# EAGLE schematic Control board (EAGLE 9.6.2)
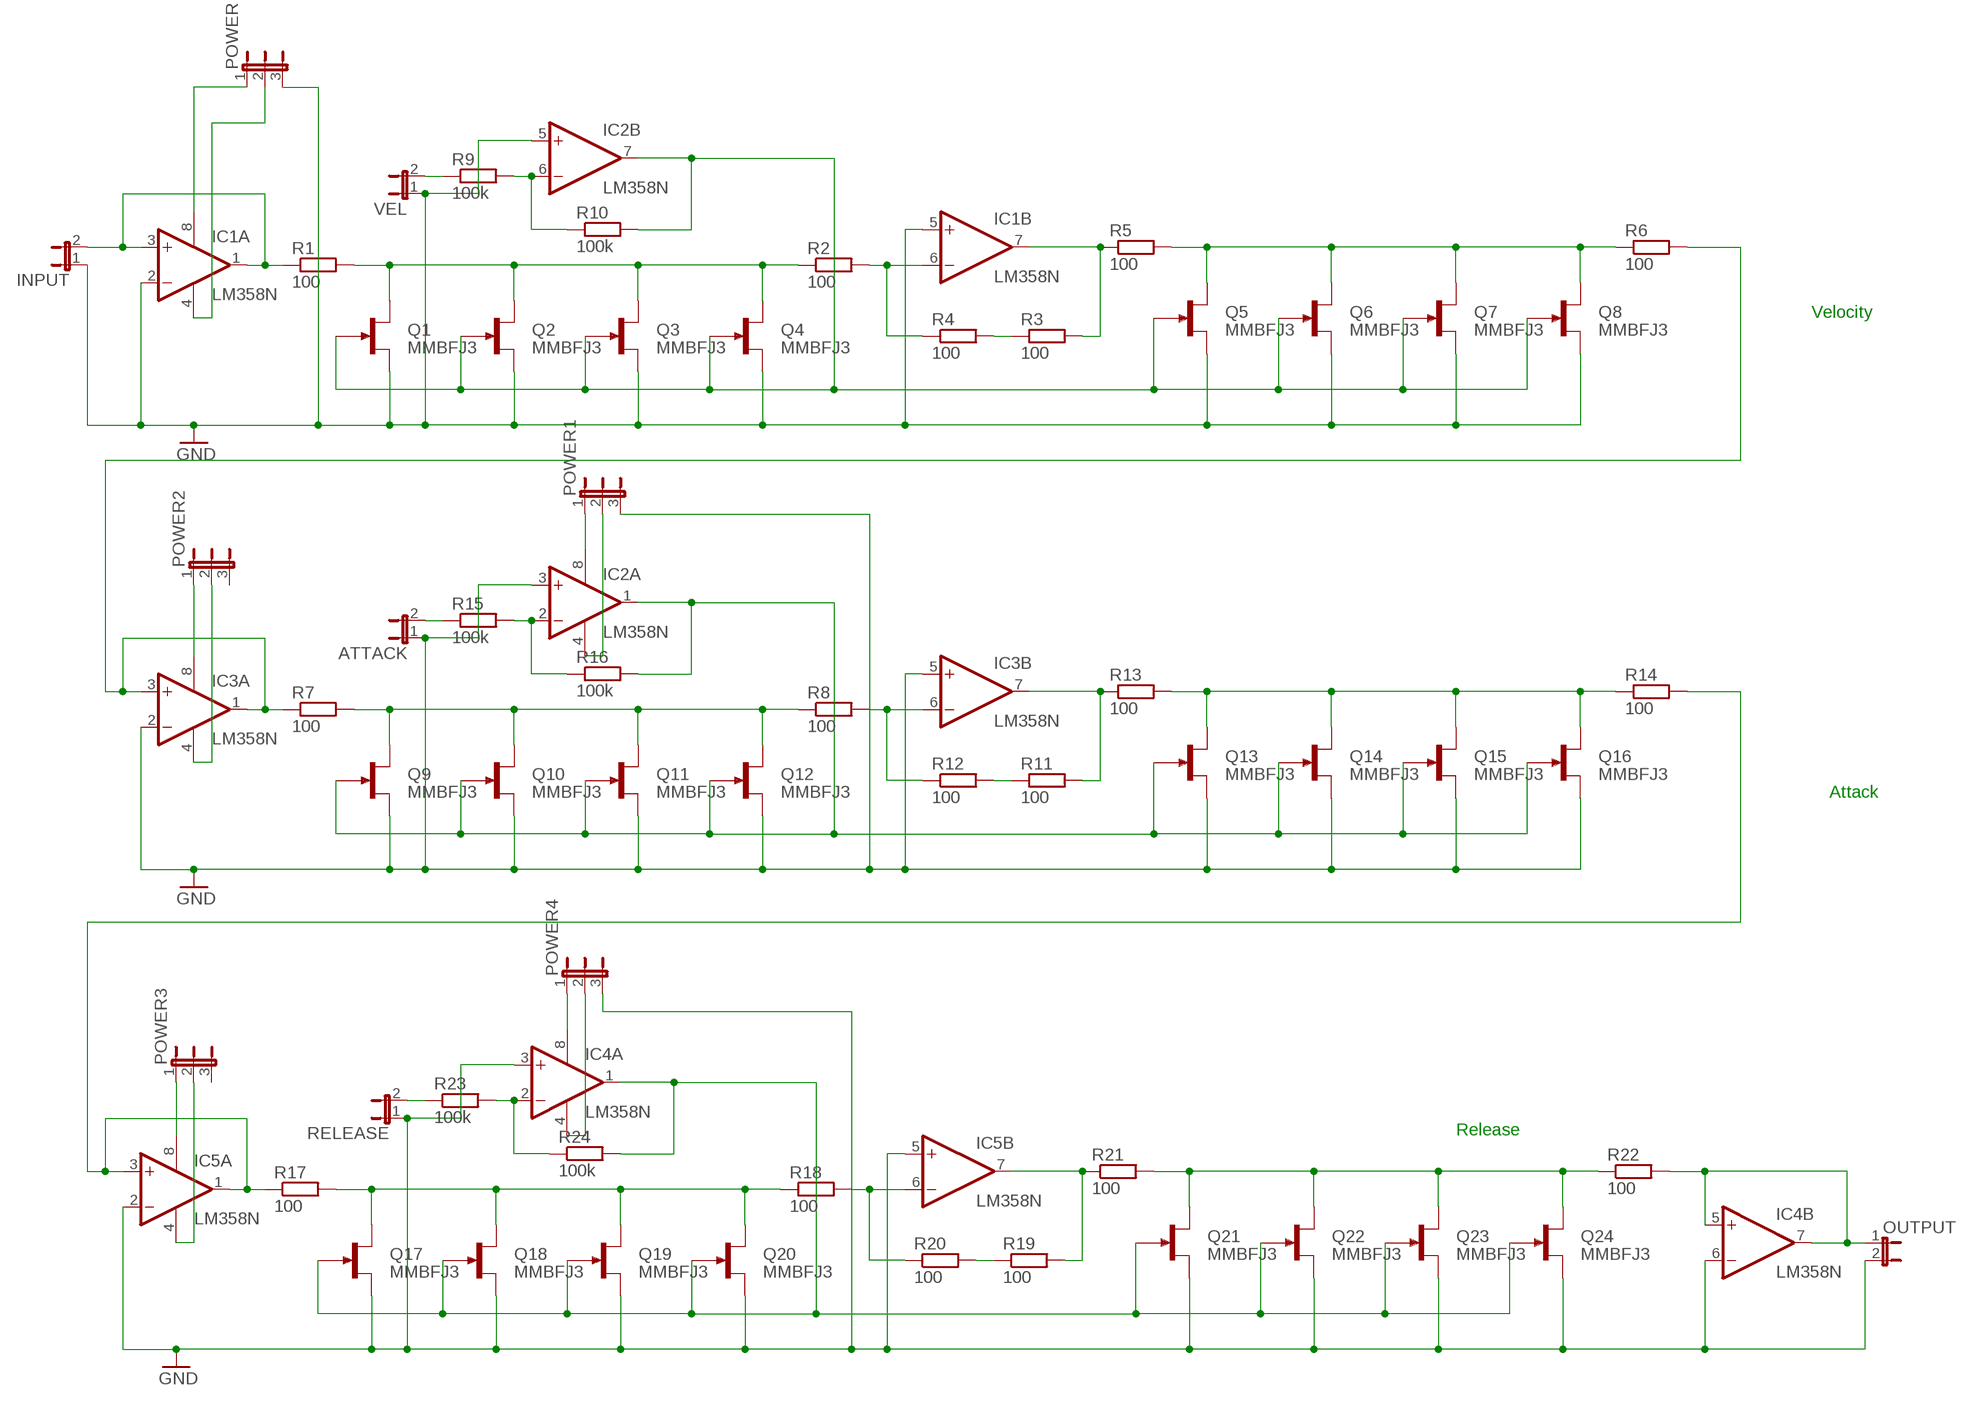
[diagram p0: schematic, sheet 1]

## Parts
ATTACK  JP1E  [JP1]
IC1  LM358N  [DIL08]
IC2  LM358N  [DIL08]
IC3  LM358N  [DIL08]
IC4  LM358N  [DIL08]
IC5  LM358N  [DIL08]
INPUT  JP1E  [JP1]
OUTPUT  JP1E  [JP1]
POWER  JP2E  [JP2]
POWER1  JP2E  [JP2]
POWER2  JP2E  [JP2]
POWER3  JP2E  [JP2]
POWER4  JP2E  [JP2]
Q1  MMBFJ3  [SOT23]
Q2  MMBFJ3  [SOT23]
Q3  MMBFJ3  [SOT23]
Q4  MMBFJ3  [SOT23]
Q5  MMBFJ3  [SOT23]
Q6  MMBFJ3  [SOT23]
Q7  MMBFJ3  [SOT23]
Q8  MMBFJ3  [SOT23]
Q9  MMBFJ3  [SOT23]
Q10  MMBFJ3  [SOT23]
Q11  MMBFJ3  [SOT23]
Q12  MMBFJ3  [SOT23]
Q13  MMBFJ3  [SOT23]
Q14  MMBFJ3  [SOT23]
Q15  MMBFJ3  [SOT23]
Q16  MMBFJ3  [SOT23]
Q17  MMBFJ3  [SOT23]
Q18  MMBFJ3  [SOT23]
Q19  MMBFJ3  [SOT23]
Q20  MMBFJ3  [SOT23]
Q21  MMBFJ3  [SOT23]
Q22  MMBFJ3  [SOT23]
Q23  MMBFJ3  [SOT23]
Q24  MMBFJ3  [SOT23]
R1  100  R-EU_0204/7  [0204/7]
R2  100  R-EU_0204/7  [0204/7]
R3  100  R-EU_0204/7  [0204/7]
R4  100  R-EU_0204/7  [0204/7]
R5  100  R-EU_0204/7  [0204/7]
R6  100  R-EU_0204/7  [0204/7]
R7  100  R-EU_0204/7  [0204/7]
R8  100  R-EU_0204/7  [0204/7]
R9  100k  R-EU_0204/7  [0204/7]
R10  100k  R-EU_0204/7  [0204/7]
R11  100  R-EU_0204/7  [0204/7]
R12  100  R-EU_0204/7  [0204/7]
R13  100  R-EU_0204/7  [0204/7]
R14  100  R-EU_0204/7  [0204/7]
R15  100k  R-EU_0204/7  [0204/7]
R16  100k  R-EU_0204/7  [0204/7]
R17  100  R-EU_0204/7  [0204/7]
R18  100  R-EU_0204/7  [0204/7]
R19  100  R-EU_0204/7  [0204/7]
R20  100  R-EU_0204/7  [0204/7]
R21  100  R-EU_0204/7  [0204/7]
R22  100  R-EU_0204/7  [0204/7]
R23  100k  R-EU_0204/7  [0204/7]
R24  100k  R-EU_0204/7  [0204/7]
RELEASE  JP1E  [JP1]
VEL  JP1E  [JP1]

## Nets
22: Q13.1(D) Q14.1(D) Q15.1(D) Q16.1(D) R13.2 R14.1
CONTROL: IC2.7(B:OUT) Q1.3(G) Q2.3(G) Q3.3(G) Q4.3(G) Q5.3(G) Q6.3(G) Q7.3(G) Q8.3(G) R10.2
CONTROL1: IC2.1(A:OUT) Q9.3(G) Q10.3(G) Q11.3(G) Q12.3(G) Q13.3(G) Q14.3(G) Q15.3(G) Q16.3(G) R16.2
CONTROL2: IC4.1(A:OUT) Q17.3(G) Q18.3(G) Q19.3(G) Q20.3(G) Q21.3(G) Q22.3(G) Q23.3(G) Q24.3(G) R24.2
GND: ATTACK.1 IC1.2(A:-IN) IC1.5(B:+IN) IC2.3(A:+IN) IC2.5(B:+IN) IC3.2(A:-IN) IC3.5(B:+IN) IC4.3(A:+IN) IC4.6(B:-IN) IC5.2(A:-IN) IC5.5(B:+IN) INPUT.1 OUTPUT.2 POWER1.3 POWER4.3 POWER.3 Q1.2(S) Q2.2(S) Q3.2(S) Q4.2(S) Q5.2(S) Q6.2(S) Q7.2(S) Q8.2(S) Q9.2(S) Q10.2(S) Q11.2(S) Q12.2(S) Q13.2(S) Q14.2(S) Q15.2(S) Q16.2(S) Q17.2(S) Q18.2(S) Q19.2(S) Q20.2(S) Q21.2(S) Q22.2(S) Q23.2(S) Q24.2(S) RELEASE.1 VEL.1
N$1: IC4.8(P:V+) POWER4.1
N$2: IC1.8(P:V+) POWER.1
N$3: IC1.6(B:-IN) R2.2 R4.1
N$4: IC1.1(A:OUT) IC1.3(A:+IN) INPUT.2 R1.1
N$5: R3.1 R4.2
N$6: IC4.4(P:V-) POWER4.2
N$7: IC1.7(B:OUT) R3.2 R5.1
N$8: R9.1 VEL.2
N$9: IC3.1(A:OUT) IC3.3(A:+IN) R6.2 R7.1
N$11: IC5.8(P:V+) POWER3.1
N$12: IC2.6(B:-IN) R9.2 R10.1
N$13: IC4.5(B:+IN) IC4.7(B:OUT) OUTPUT.1 R22.2
N$14: IC5.4(P:V-) POWER3.2
N$15: IC3.6(B:-IN) R8.2 R12.1
N$16: R11.1 R12.2
N$17: IC3.7(B:OUT) R11.2 R13.1
N$18: IC3.8(P:V+) POWER2.1
N$19: IC5.1(A:OUT) IC5.3(A:+IN) R14.2 R17.1
N$20: ATTACK.2 R15.1
N$21: IC2.2(A:-IN) R15.2 R16.1
N$22: IC3.4(P:V-) POWER2.2
N$23: IC2.8(P:V+) POWER1.1
N$24: IC1.4(P:V-) POWER.2
N$25: IC2.4(P:V-) POWER1.2
N$26: IC5.6(B:-IN) R18.2 R20.1
N$27: R19.1 R20.2
N$28: IC5.7(B:OUT) R19.2 R21.1
N$31: R23.1 RELEASE.2
N$32: IC4.2(A:-IN) R23.2 R24.1
NET11: Q1.1(D) Q2.1(D) Q3.1(D) Q4.1(D) R1.2 R2.1
NET12: Q5.1(D) Q6.1(D) Q7.1(D) Q8.1(D) R5.2 R6.1
NET21: Q9.1(D) Q10.1(D) Q11.1(D) Q12.1(D) R7.2 R8.1
NET31: Q17.1(D) Q18.1(D) Q19.1(D) Q20.1(D) R17.2 R18.1
NET32: Q21.1(D) Q22.1(D) Q23.1(D) Q24.1(D) R21.2 R22.1
Unconnected: POWER2.3 POWER3.3

## Notes on the sheet
- Velocity
- Attack
- Release

## Library data of the parts
ATTACK INPUT OUTPUT RELEASE VEL = jumper:JP1E: JUMPER
IC1-IC5 = linear:LM358: OP AMP also LM158; LM258; LM2904 Source: http://cache.national.com/ds/LM/LM158.pdf
POWER POWER1-POWER4 = jumper:JP2E: JUMPER
Q1-Q24 = transistor-small-signal:MMBFJ3*: N-Channel RF Amplifier Source: http://www.fairchildsemi.com/pf/J3/J310.html
R1-R24 = rcl:R-EU_: RESISTOR, European symbol; SPICEPREFIX: R